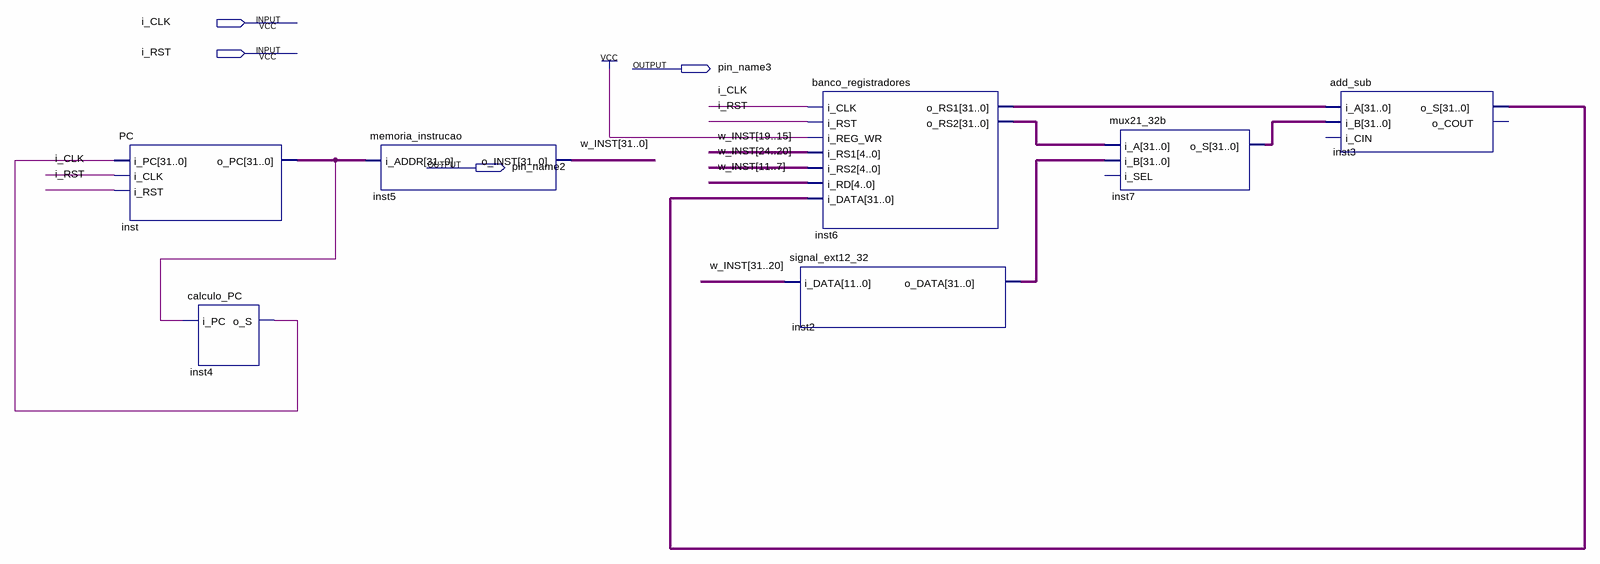
[diagram p0: schematic sheet]
// Quartus schematic risc_v32i.bdf as structural Verilog: 7 symbols, 4 pins
module risc_v32i (
  input  i_CLK,
  input  i_RST,
  output pin_name3,
  output pin_name2
);

  wire inst4_o_s, undriven;
  wire [31:0] inst2_o_data, inst3_o_s, inst6_o_rs1, inst6_o_rs2, inst7_o_s, inst_o_pc, w_INST;

  PC inst (.i_PC({32{inst4_o_s}}), .i_CLK(i_CLK), .i_RST(i_RST), .o_PC(inst_o_pc));
  calculo_PC inst4 (.i_PC(undriven), .o_S(inst4_o_s));
  memoria_instrucao inst5 (.i_ADDR(inst_o_pc), .o_INST(w_INST));
  banco_registradores inst6 (
    .i_CLK(i_CLK), .i_RST(i_RST), .i_REG_WR(1'b1), .i_RS1(w_INST[19:15]), .i_RS2(w_INST[24:20]),
    .i_RD(w_INST[11:7]), .i_DATA(inst3_o_s), .o_RS1(inst6_o_rs1), .o_RS2(inst6_o_rs2));
  signal_ext12_32 inst2 (.i_DATA(w_INST[31:20]), .o_DATA(inst2_o_data));
  mux21_32b inst7 (.i_A(inst6_o_rs2), .i_B(inst2_o_data), .o_S(inst7_o_s));  // open: i_SEL
  add_sub inst3 (.i_A(inst6_o_rs1), .i_B(inst7_o_s), .o_S(inst3_o_s));  // open: i_CIN, o_COUT
endmodule
